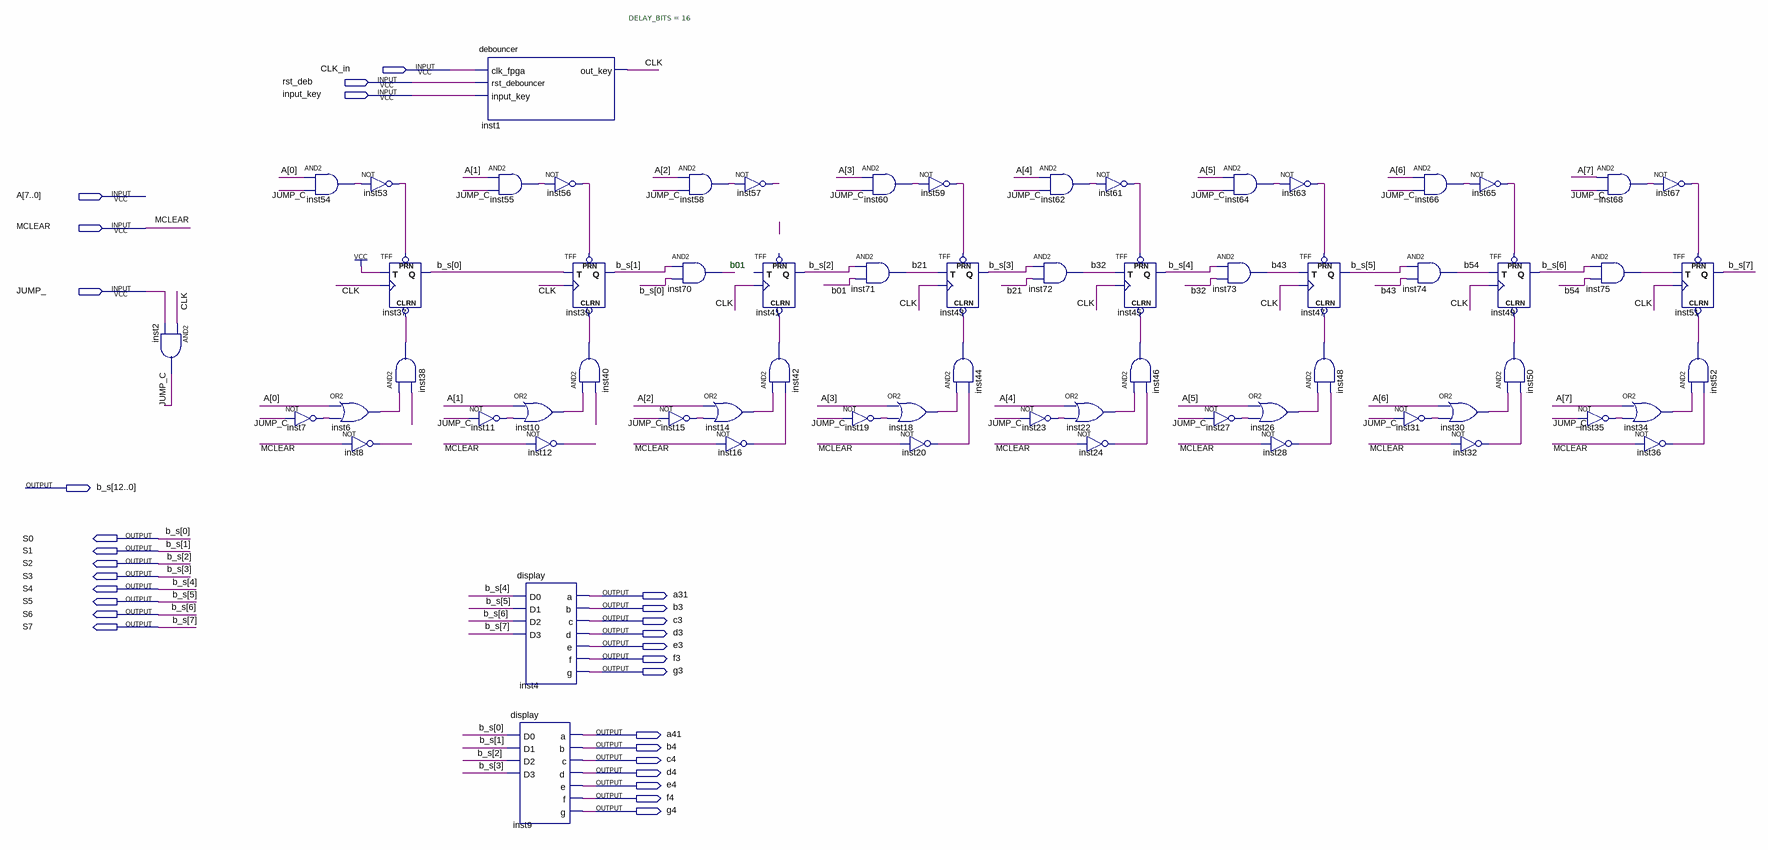
[diagram p0: schematic sheet]
// Quartus schematic COUNT_NO_DISPLAY.bdf as structural Verilog: 66 symbols, 29 pins
module COUNT_NO_DISPLAY (
  input  CLK_in,
  input  rst_deb,
  input  input_key,
  input  [7:0] A,
  input  MCLEAR,
  input  JUMP_,
  output [12:0] b_s,
  output S0,
  output S1,
  output S2,
  output S3,
  output S4,
  output a31,
  output S5,
  output b3,
  output S6,
  output c3,
  output S7,
  output d3,
  output e3,
  output f3,
  output g3,
  output a41,
  output b4,
  output c4,
  output d4,
  output e4,
  output f4,
  output g4
);

  wire b01, b21, b32, b43, b54, CLK, inst6_out, inst7_out, inst8_out, inst10_out, inst11_out, inst12_out,
       inst14_out, inst15_out, inst16_out, inst18_out, inst19_out, inst20_out, inst22_out, inst23_out,
       inst24_out, inst26_out, inst27_out, inst28_out, inst30_out, inst31_out, inst32_out, inst34_out,
       inst35_out, inst36_out, inst38_out, inst40_out, inst42_out, inst44_out, inst46_out, inst48_out,
       inst50_out, inst52_out, inst53_out, inst54_out, inst55_out, inst56_out, inst57_out, inst58_out,
       inst59_out, inst60_out, inst61_out, inst62_out, inst63_out, inst64_out, inst65_out, inst66_out,
       inst67_out, inst68_out, inst75_out, JUMP_C, undriven, undriven_2;

  and inst2 (JUMP_C, CLK, JUMP_);
  not inst7 (inst7_out, JUMP_C);
  and inst54 (inst54_out, A[0], JUMP_C);
  or inst6 (inst6_out, A[0], inst7_out);
  not inst8 (inst8_out, MCLEAR);
  not inst53 (inst53_out, inst54_out);
  TFF inst37 (.PRN(inst53_out), .CLRN(inst38_out), .T(1'b1), .CLK(CLK), .Q(b_s[0]));
  and inst38 (inst38_out, inst6_out, undriven);
  debouncer #(.DELAY_BITS(16)) inst1 (.clk_fpga(CLK_in), .rst_debouncer(rst_deb), .input_key(input_key), .out_key(CLK));
  and inst55 (inst55_out, A[1], JUMP_C);
  not inst11 (inst11_out, JUMP_C);
  not inst56 (inst56_out, inst55_out);
  or inst10 (inst10_out, A[1], inst11_out);
  not inst12 (inst12_out, MCLEAR);
  display inst4 (
    .D0(b_s[4]), .D1(b_s[5]), .D2(b_s[6]), .D3(b_s[7]), .a(a31), .b(b3), .c(c3), .d(d3), .e(e3), .f(f3),
    .g(g3));
  display inst9 (
    .D0(b_s[0]), .D1(b_s[1]), .D2(b_s[2]), .D3(b_s[3]), .a(a41), .b(b4), .c(c4), .d(d4), .e(e4), .f(f4),
    .g(g4));
  TFF inst39 (.PRN(inst56_out), .CLRN(inst40_out), .T(b_s[0]), .CLK(CLK), .Q(b_s[1]));
  and inst40 (inst40_out, inst10_out, undriven_2);
  and inst58 (inst58_out, A[2], JUMP_C);
  and inst70 (b01, b_s[1], b_s[0]);
  not inst15 (inst15_out, JUMP_C);
  not inst57 (inst57_out, inst58_out);
  or inst14 (inst14_out, A[2], inst15_out);
  not inst16 (inst16_out, MCLEAR);
  TFF inst41 (.CLRN(inst42_out), .CLK(CLK), .Q(b_s[2]));  // open: PRN, T
  and inst42 (inst42_out, inst14_out, inst16_out);
  not inst19 (inst19_out, JUMP_C);
  and inst60 (inst60_out, A[3], JUMP_C);
  and inst71 (b21, b_s[2], b01);
  or inst18 (inst18_out, A[3], inst19_out);
  not inst20 (inst20_out, MCLEAR);
  not inst59 (inst59_out, inst60_out);
  TFF inst43 (.PRN(inst59_out), .CLRN(inst44_out), .T(b21), .CLK(CLK), .Q(b_s[3]));
  and inst44 (inst44_out, inst18_out, inst20_out);
  and inst62 (inst62_out, A[4], JUMP_C);
  and inst72 (b32, b_s[3], b21);
  not inst23 (inst23_out, JUMP_C);
  not inst61 (inst61_out, inst62_out);
  or inst22 (inst22_out, A[4], inst23_out);
  not inst24 (inst24_out, MCLEAR);
  TFF inst45 (.PRN(inst61_out), .CLRN(inst46_out), .T(b32), .CLK(CLK), .Q(b_s[4]));
  and inst46 (inst46_out, inst22_out, inst24_out);
  not inst27 (inst27_out, JUMP_C);
  and inst64 (inst64_out, A[5], JUMP_C);
  and inst73 (b43, b_s[4], b32);
  or inst26 (inst26_out, A[5], inst27_out);
  not inst63 (inst63_out, inst64_out);
  TFF inst47 (.PRN(inst63_out), .CLRN(inst48_out), .T(b43), .CLK(CLK), .Q(b_s[5]));
  and inst48 (inst48_out, inst26_out, inst28_out);
  not inst28 (inst28_out, MCLEAR);
  and inst74 (b54, b_s[5], b43);
  not inst31 (inst31_out, JUMP_C);
  and inst66 (inst66_out, A[6], JUMP_C);
  or inst30 (inst30_out, A[6], inst31_out);
  not inst32 (inst32_out, MCLEAR);
  not inst65 (inst65_out, inst66_out);
  TFF inst49 (.PRN(inst65_out), .CLRN(inst50_out), .T(b54), .CLK(CLK), .Q(b_s[6]));
  and inst50 (inst50_out, inst30_out, inst32_out);
  and inst68 (inst68_out, A[7], JUMP_C);
  and inst75 (inst75_out, b_s[6], b54);
  not inst35 (inst35_out, JUMP_C);
  not inst67 (inst67_out, inst68_out);
  or inst34 (inst34_out, A[7], inst35_out);
  not inst36 (inst36_out, MCLEAR);
  TFF inst51 (.PRN(inst67_out), .CLRN(inst52_out), .T(inst75_out), .CLK(CLK), .Q(b_s[7]));
  and inst52 (inst52_out, inst34_out, inst36_out);

  assign S0 = b_s[0];
  assign S1 = b_s[1];
  assign S2 = b_s[2];
  assign S3 = b_s[3];
  assign S4 = b_s[4];
  assign S5 = b_s[5];
  assign S6 = b_s[6];
  assign S7 = b_s[7];

  // Notes on the sheet:
  //   b01
endmodule
